# Altium schematic sheet 4 - DDR2 DRAM.SchDoc
size A3
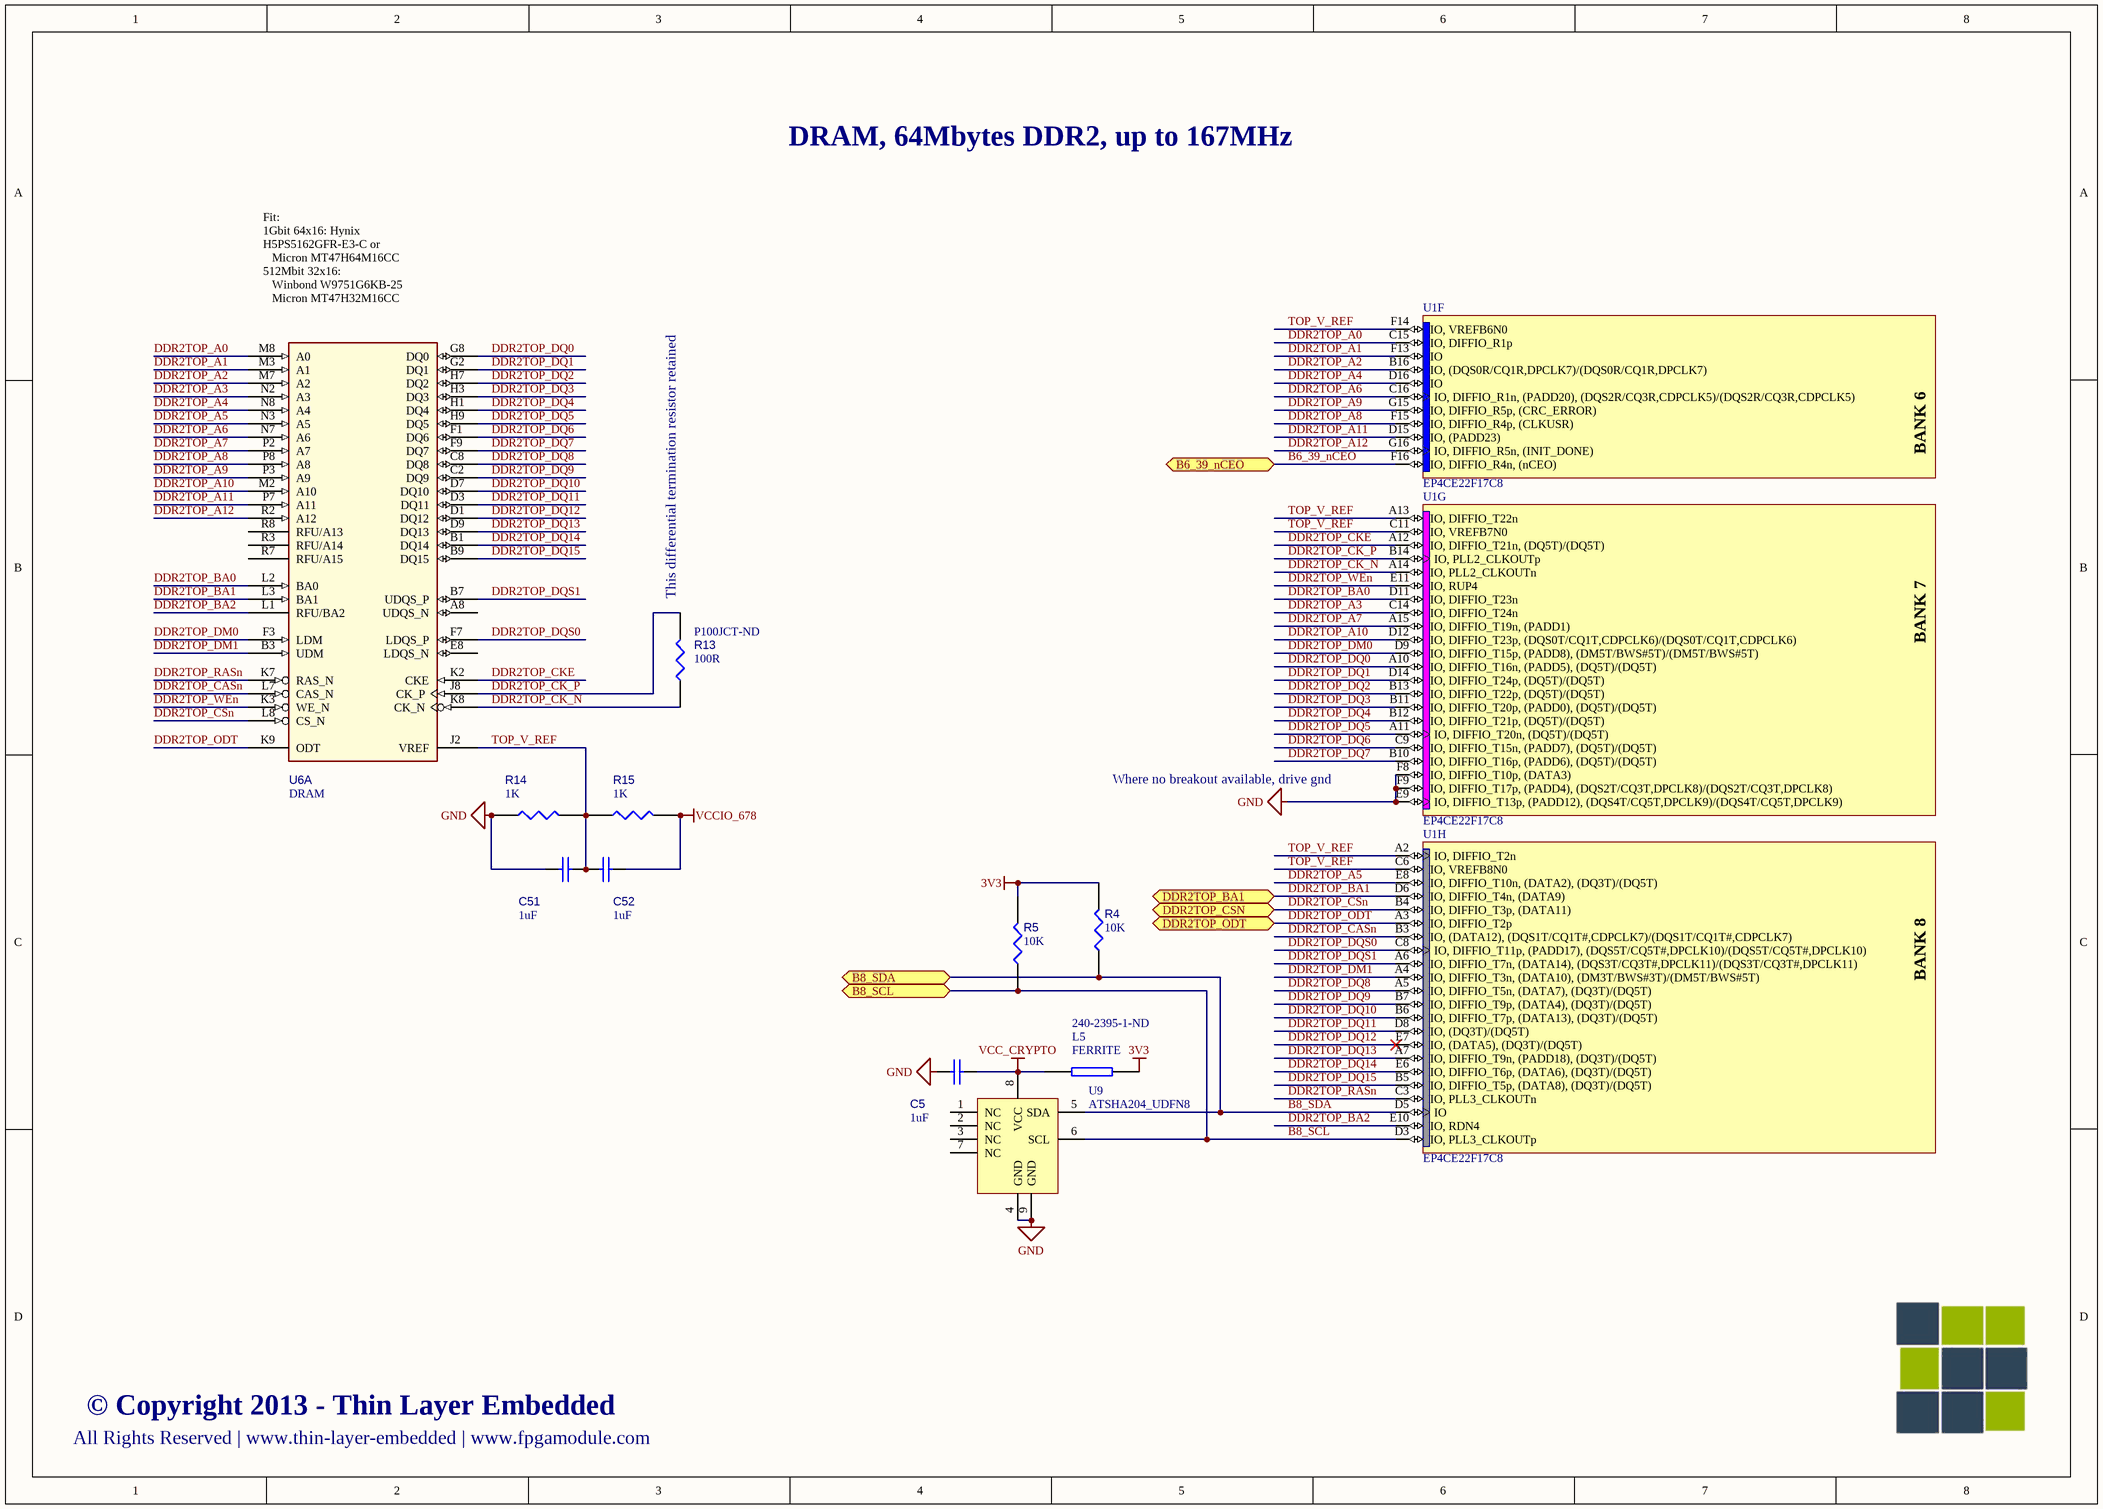
[diagram p0: 4 - DDR2 DRAM.SchDoc]

## Parts
C5  1uF  [0402_HD]
C51  1uF  [0402_HD]
C52  1uF  [0402_HD]
L5  FERRITE  Supplier Part Number 1: 240-2395-1-ND  [0402_HD]
R4  10K  [0402_HD]
R5  10K  [0402_HD]
R13  100R  Supplier Part Number 1: P100JCT-ND  [0402_HD]
R14  1K  [0402_HD]
R15  1K  [0402_HD]
U1  EP4CE22F17C8  [FBGA256]  (parts F,G,H of 13)
U6  DRAM  [DDR2_84_SPEC_HD]  (part A of 2)
U9  ATSHA204_UDFN8  [UDFN8]

## Ports
B6_39_nCEO, B8_SCL, B8_SDA, DDR2TOP_BA1, DDR2TOP_CSN, DDR2TOP_ODT

## Nets
3V3: L5.2 R4.1 R5.1
GND: C5.2 C51.2 R14.2 U1.E9(IO,_DIFFIO_T13p,_(PADD12),_(DQS4T/CQ5T,DPCLK9)/(DQS4T/CQ5T,DPCLK9)) U1.F8(IO,_DIFFIO_T10p,_(DATA3)) U1.F9(IO,_DIFFIO_T17p,_(PADD4),_(DQS2T/CQ3T,DPCLK8)/(DQS2T/CQ3T,DPCLK8)) U9.4(GND) U9.9(GND)
VCC_CRYPTO: C5.1 L5.1 U9.8(VCC)
VCCIO_678: C52.1 R15.1
B6_39_nCEO: U1.F16(IO,_DIFFIO_R4n,_(nCEO)) ; port B6_39_nCEO
B8_SCL: R5.2 U1.D3(IO,_PLL3_CLKOUTp) U9.6(SCL) ; port B8_SCL
B8_SDA: R4.2 U1.D5(IO) U9.5(SDA) ; port B8_SDA
DDR2TOP_A0: U1.C15(IO,_DIFFIO_R1p) U6.M8(A0)
DDR2TOP_A1: U1.F13(IO) U6.M3(A1)
DDR2TOP_A2: U1.B16(IO,_(DQS0R/CQ1R,DPCLK7)/(DQS0R/CQ1R,DPCLK7)) U6.M7(A2)
DDR2TOP_A3: U1.C14(IO,_DIFFIO_T24n) U6.N2(A3)
DDR2TOP_A4: U1.D16(IO) U6.N8(A4)
DDR2TOP_A5: U1.E8(IO,_DIFFIO_T10n,_(DATA2),_(DQ3T)/(DQ5T)) U6.N3(A5)
DDR2TOP_A6: U1.C16(IO,_DIFFIO_R1n,_(PADD20),_(DQS2R/CQ3R,CDPCLK5)/(DQS2R/CQ3R,CDPCLK5)) U6.N7(A6)
DDR2TOP_A7: U1.A15(IO,_DIFFIO_T19n,_(PADD1)) U6.P2(A7)
DDR2TOP_A8: U1.F15(IO,_DIFFIO_R4p,_(CLKUSR)) U6.P8(A8)
DDR2TOP_A9: U1.G15(IO,_DIFFIO_R5p,_(CRC_ERROR)) U6.P3(A9)
DDR2TOP_A10: U1.D12(IO,_DIFFIO_T23p,_(DQS0T/CQ1T,CDPCLK6)/(DQS0T/CQ1T,CDPCLK6)) U6.M2(A10)
DDR2TOP_A11: U1.D15(IO,_(PADD23)) U6.P7(A11)
DDR2TOP_A12: U1.G16(IO,_DIFFIO_R5n,_(INIT_DONE)) U6.R2(A12)
DDR2TOP_BA0: U1.D11(IO,_DIFFIO_T23n) U6.L2(BA0)
DDR2TOP_BA1: U1.D6(IO,_DIFFIO_T4n,_(DATA9)) U6.L3(BA1) ; port DDR2TOP_BA1
DDR2TOP_BA2: U1.E10(IO,_RDN4) U6.L1(RFU/BA2)
DDR2TOP_CASn: U1.B3(IO,_(DATA12),_(DQS1T/CQ1T#,CDPCLK7)/(DQS1T/CQ1T#,CDPCLK7)) U6.L7(CAS_N)
DDR2TOP_CK_N: R13.2 U1.A14(IO,_PLL2_CLKOUTn) U6.K8(CK_N)
DDR2TOP_CK_P: R13.1 U1.B14(IO,_PLL2_CLKOUTp) U6.J8(CK_P)
DDR2TOP_CKE: U1.A12(IO,_DIFFIO_T21n,_(DQ5T)/(DQ5T)) U6.K2(CKE)
DDR2TOP_CSn: U1.B4(IO,_DIFFIO_T3p,_(DATA11)) U6.L8(CS_N) ; port DDR2TOP_CSN
DDR2TOP_DM0: U1.D9(IO,_DIFFIO_T15p,_(PADD8),_(DM5T/BWS#5T)/(DM5T/BWS#5T)) U6.F3(LDM)
DDR2TOP_DM1: U1.A4(IO,_DIFFIO_T3n,_(DATA10),_(DM3T/BWS#3T)/(DM5T/BWS#5T)) U6.B3(UDM)
DDR2TOP_DQ0: U1.A10(IO,_DIFFIO_T16n,_(PADD5),_(DQ5T)/(DQ5T)) U6.G8(DQ0)
DDR2TOP_DQ1: U1.D14(IO,_DIFFIO_T24p,_(DQ5T)/(DQ5T)) U6.G2(DQ1)
DDR2TOP_DQ2: U1.B13(IO,_DIFFIO_T22p,_(DQ5T)/(DQ5T)) U6.H7(DQ2)
DDR2TOP_DQ3: U1.B11(IO,_DIFFIO_T20p,_(PADD0),_(DQ5T)/(DQ5T)) U6.H3(DQ3)
DDR2TOP_DQ4: U1.B12(IO,_DIFFIO_T21p,_(DQ5T)/(DQ5T)) U6.H1(DQ4)
DDR2TOP_DQ5: U1.A11(IO,_DIFFIO_T20n,_(DQ5T)/(DQ5T)) U6.H9(DQ5)
DDR2TOP_DQ6: U1.C9(IO,_DIFFIO_T15n,_(PADD7),_(DQ5T)/(DQ5T)) U6.F1(DQ6)
DDR2TOP_DQ7: U1.B10(IO,_DIFFIO_T16p,_(PADD6),_(DQ5T)/(DQ5T)) U6.F9(DQ7)
DDR2TOP_DQ8: U1.A5(IO,_DIFFIO_T5n,_(DATA7),_(DQ3T)/(DQ5T)) U6.C8(DQ8)
DDR2TOP_DQ9: U1.B7(IO,_DIFFIO_T9p,_(DATA4),_(DQ3T)/(DQ5T)) U6.C2(DQ9)
DDR2TOP_DQ10: U1.B6(IO,_DIFFIO_T7p,_(DATA13),_(DQ3T)/(DQ5T)) U6.D7(DQ10)
DDR2TOP_DQ11: U1.D8(IO,_(DQ3T)/(DQ5T)) U6.D3(DQ11)
DDR2TOP_DQ12: U1.E7(IO,_(DATA5),_(DQ3T)/(DQ5T)) U6.D1(DQ12)
DDR2TOP_DQ13: U1.A7(IO,_DIFFIO_T9n,_(PADD18),_(DQ3T)/(DQ5T)) U6.D9(DQ13)
DDR2TOP_DQ14: U1.E6(IO,_DIFFIO_T6p,_(DATA6),_(DQ3T)/(DQ5T)) U6.B1(DQ14)
DDR2TOP_DQ15: U1.B5(IO,_DIFFIO_T5p,_(DATA8),_(DQ3T)/(DQ5T)) U6.B9(DQ15)
DDR2TOP_DQS0: U1.C8(IO,_DIFFIO_T11p,_(PADD17),_(DQS5T/CQ5T#,DPCLK10)/(DQS5T/CQ5T#,DPCLK10)) U6.F7(LDQS_P)
DDR2TOP_DQS1: U1.A6(IO,_DIFFIO_T7n,_(DATA14),_(DQS3T/CQ3T#,DPCLK11)/(DQS3T/CQ3T#,DPCLK11)) U6.B7(UDQS_P)
DDR2TOP_ODT: U1.A3(IO,_DIFFIO_T2p) U6.K9(ODT) ; port DDR2TOP_ODT
DDR2TOP_RASn: U1.C3(IO,_PLL3_CLKOUTn) U6.K7(RAS_N)
DDR2TOP_WEn: U1.E11(IO,_RUP4) U6.K3(WE_N)
TOP_V_REF: C51.1 C52.2 R14.1 R15.2 U1.A2(IO,_DIFFIO_T2n) U1.A13(IO,_DIFFIO_T22n) U1.C6(IO,_VREFB8N0) U1.C11(IO,_VREFB7N0) U1.F14(IO,_VREFB6N0) U6.J2(VREF)

Not connected (* = marked no-connect by the designer): U6 A8(UDQS_N) E8(LDQS_N) R3(RFU/A14) R7(RFU/A15) R8(RFU/A13); U9 1(NC) 2(NC) 3(NC) 7(NC)

## Notes on the sheet
- DRAM, 64Mbytes DDR2, up to 167MHz
- Fit:
  1Gbit 64x16: Hynix H5PS5162GFR-E3-C or
  Micron MT47H64M16CC
  512Mbit 32x16:
  Winbond W9751G6KB-25
  Micron MT47H32M16CC
- (near R13) This differential termination resistor retained
- Where no breakout available, drive gnd
- All Rights Reserved | www.thin-layer-embedded | www.fpgamodule.com
- © Copyright 2013 - Thin Layer Embedded
- (in symbol EP4CE22F17C8, part F) BANK 6
- (in symbol EP4CE22F17C8, part G) BANK 7
- (in symbol EP4CE22F17C8, part H) BANK 8

## Library data of the parts
C5 C51 C52 = CAP: Capacitor; Supplier 1: Digi-Key; Supplier Part Number 1: 587-1231-2-ND
L5 = FERRITE: Manufacturer: Laird-Signal Integrity Products; Manufacturer Part Number: HI0805R800R-10; Description: FERRITE CHIP POWER 80 OHM SMD; Impedance @ Frequency: 80 Ohm @ 100MHz; Current Rating: 5A; DC Resistance (DCR): 10.00 mOhm Max; Filter Type: Differential Mode - Single; Number of Lines: 1; Supplier 1: Digi-Key; RoHS: RoHS Compliant; Category: Filters; Stock 1: 36575; Pricing 1: 10=0.089, 50=0.0768, 100=0.0708, 250=0.059, 500=0.0531, 1000=0.0472 (USD); Package / Case: 0805 (2012 metric); Mounting Type: Surface Mount; Packaging: Cut Tape (CT); ComponentLink1URL: http://www.steward.com/view_print.asp?St_PartNo=HI0805R800R-10; ComponentLink1Description: http://www.steward.com/view_print.asp?St_PartNo=HI0805R800R-10
R4 R5 = RES1
R13 = RES1: Manufacturer: Panasonic - ECG; Manufacturer Part Number: ERJ-2GEJ101X; Description: RES 100 OHM 1/10W 5% 0402 SMD; Resistance (Ohms): 100; Power (Watts): 0.1W, 1/10W; Temperature Coefficient: ±200ppm/°C; Tolerance: ±5%; Supplier 1: Digi-Key; RoHS: RoHS Compliant; Category: Resistors; Stock 1: 2686964; Pricing 1: 1=0.05, 50=0.0172, 100=0.0131, 250=0.00976, 500=0.0072, 1000=0.0048, 5000=0.00338 (USD); Composition: Thick Film; Features: -; Size / Dimension: 0.039" L x 0.020" W (1.00mm x 0.50mm); Height: 0.016" (0.40mm); Number of Terminations: 2; Packaging: Cut Tape (CT); Package / Case: 0402 (1005 Metric); ComponentLink1URL: http://industrial.panasonic.com/www-cgi/jvcr13pz.cgi?E+PZ+3+AOA0001+ERJ2GEJ101X+7+WW; ComponentLink1Description: http://industrial.panasonic.com/www-cgi/jvcr13pz.cgi?E+PZ+3+AOA0001+ERJ2GEJ101X+7+WW
R14 R15 = RES1: Manufacturer: Yageo; Manufacturer Part Number: RC0603JR-071KL; Description: RES 1.0K OHM 1/10W 5% 0603 SMD; Power (Watts): 0.1W, 1/10W; Temperature Coefficient: ±100ppm/°C; Tolerance: ±5%; Supplier 1: Digi-Key; RoHS: RoHS Compliant; Category: Resistors; Stock 1: 5591800; Pricing 1: 10=0.01, 50=0.008, 100=0.006, 250=0.00448, 500=0.00332, 1000=0.00221 (USD); Resistance (Ohms): 1K; Composition: Thick Film; Features: -; Size / Dimension: 0.063" L x 0.031" W (1.60mm x 0.80mm); Height: 0.018" (0.45mm); Number of Terminations: 2; Packaging: Cut Tape (CT); Package / Case: 0603 (1608 Metric); ComponentLink1URL: http://www.yageo.com/documents/recent/PYu-RC0603_51_RoHS_L_4.pdf; ComponentLink1Description: http://www.yageo.com/documents/recent/PYu-RC0603_51_RoHS_L_4.pdf; Supplier 2: Digi-Key; Supplier Part Number 2: P1.0KJCT-ND; Stock 2: 5981822; Pricing 2: 1=0.05, 50=0.0172, 100=0.0131, 250=0.00976, 500=0.0072, 1000=0.0048, 5000=0.00338 (USD); ComponentLink2URL: http://industrial.panasonic.com/www-cgi/jvcr13pz.cgi?E+PZ+3+AOA0001+ERJ2GEJ102X+7+WW; ComponentLink2Description: http://industrial.panasonic.com/www-cgi/jvcr13pz.cgi?E+PZ+3+AOA0001+ERJ2GEJ102X+7+WW
U1 = EP4CE22F17C8: Cyclone IV Family FPGA, 2V Core, 153 I/O Pins, 4 PLLs, 256-Pin FBGA, Speed Grade 8, Commercial Grade; Published: 3-May-2010; DatasheetVersion: ver1.2, Mar-2010; PackageVersion: ver16.0, Dec-2009; PackageReference: FBGA256; Publisher: Altium Limited; PackageDescription: 256-Ball FineLine Ball Grid Array (FBGA256) - Option 1 - Wire Bond; Code_JEDEC: MS-034-AAF-1; Code_IPC: BGA100P16X16-256; ComponentLink1Description: Manufacturer Link; ComponentLink1URL: http://www.altera.com/; ComponentLink2Description: Handbook; ComponentLink2URL: http://www.altera.com/literature/hb/cyclone-iv/cyclone4-handbook.pdf; ComponentLink3Description: Pinout Specification; ComponentLink3URL: http://www.altera.com/literature/lit-dp.jsp?category=cyc%204&showspreadsheet=y; ComponentLink4Description: Packaging Specification; ComponentLink4URL: http://www.altera.com/literature/ds/dspkg.pdf
U6 = MT47H32M16CC: IC DDR2 SDRAM 32M X 16 4 BANKS 333MHZ CAS LATENCY 5 FBGA PACKAGE 84 PINS 1.8V CORE 1.8V IO